# EAGLE schematic Shkaff (EAGLE 7.0.0)
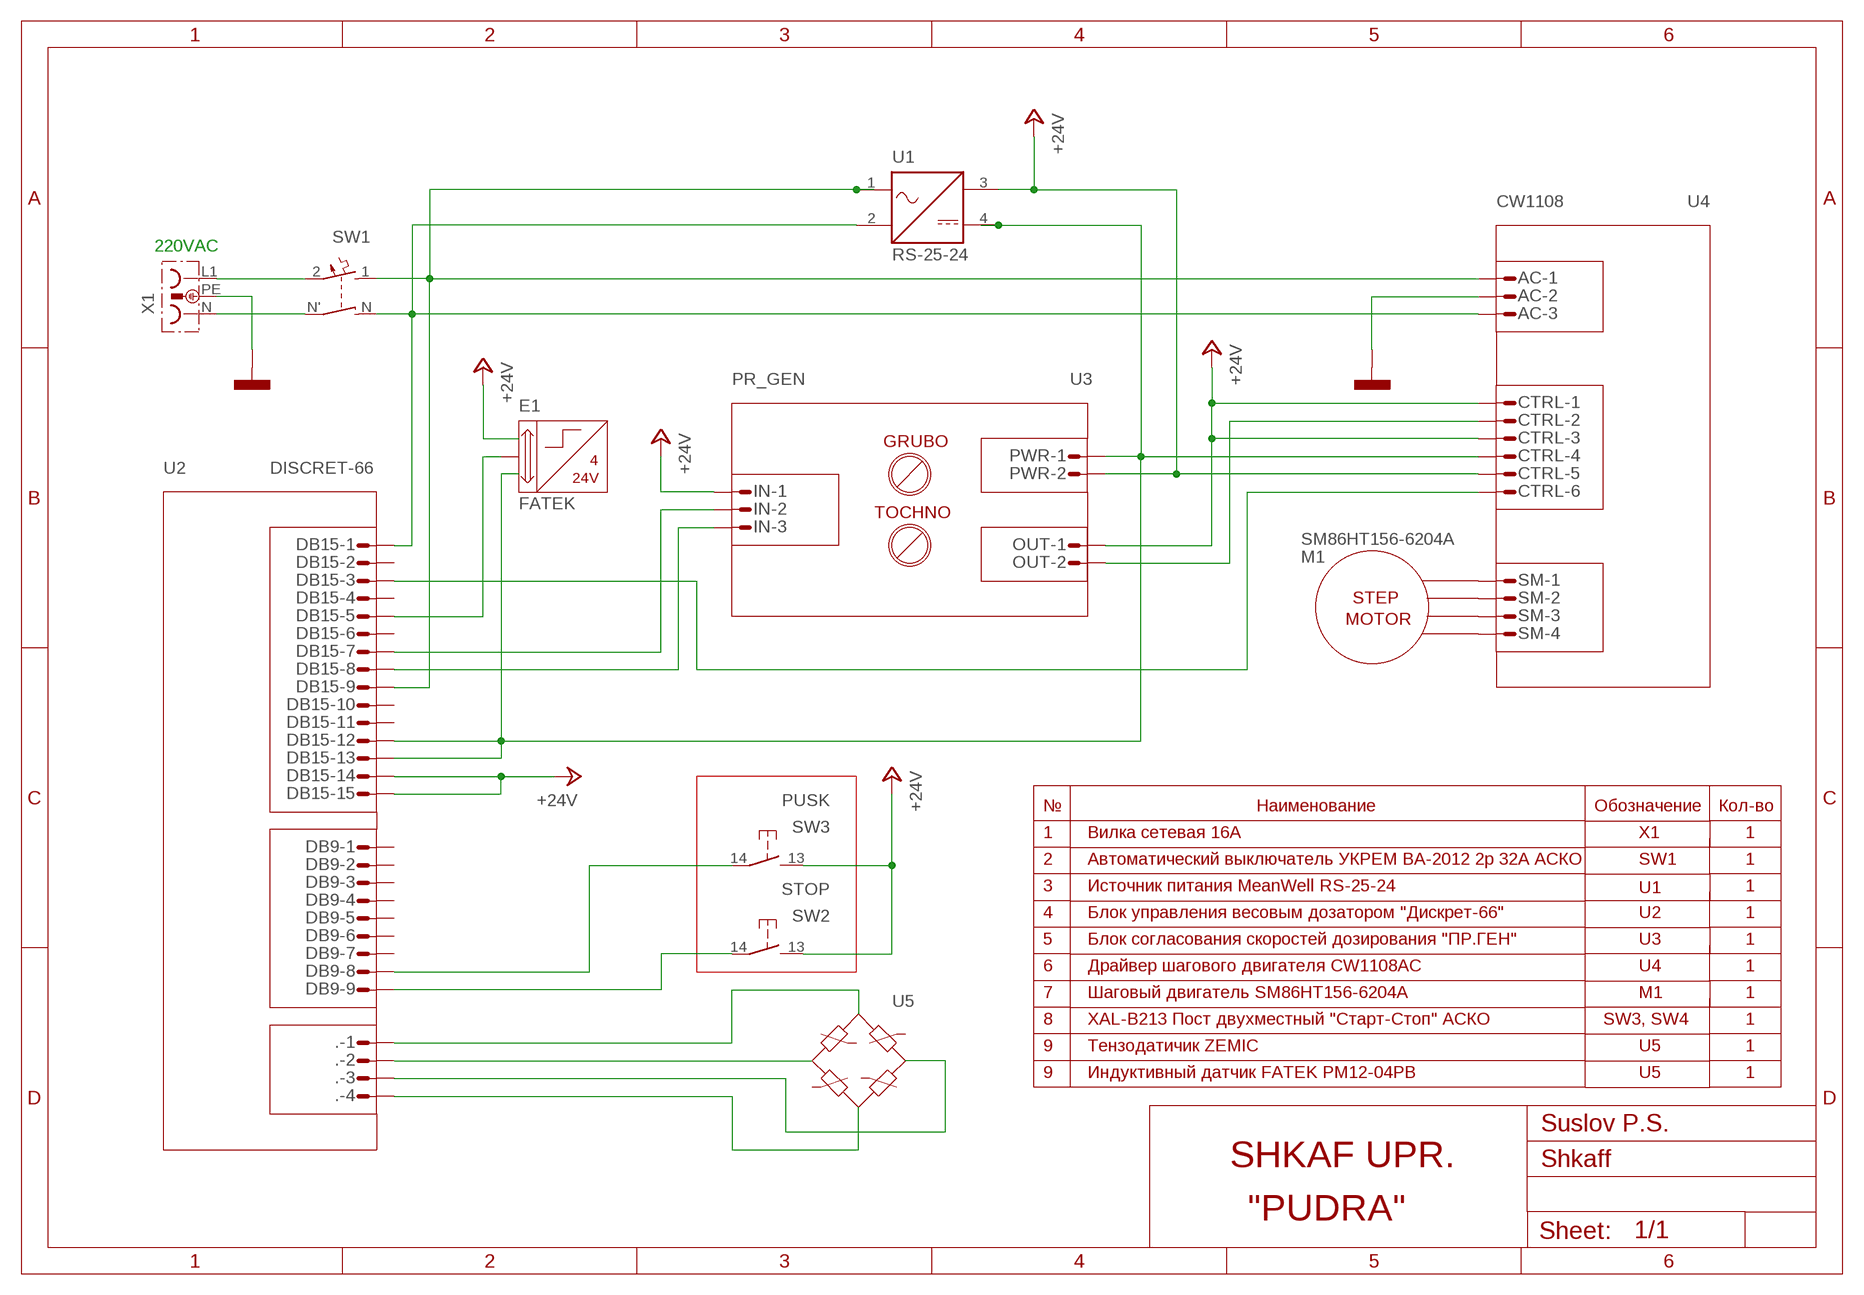
[diagram p0: schematic, sheet 1]

## Parts
.  L04P  [L04P]
AC  L04P  [L04P]
CTRL  L09P  [L09P]
DB9  L09P  [L09P]
DB15  L15P  [L15P]
E1  FATEK  6158EB  [6158EB]
IN  L04P  [L04P]
OUT  L04P  [L04P]
PWR  L04P  [L04P]
SM  L04P  [L04P]
SW1  LEITUNGSSCHUTZSCHALTER_2-POL  [LEITUNGSSCHUTZSCHALTER_2-POL]
SW2  STOP  SCHLIESSER_TASTSCHALTER  [SCHLIESSER_TASTSCHALTER]
SW3  PUSK  SCHLIESSER_TASTSCHALTER  [SCHLIESSER_TASTSCHALTER]
U1  RS-25-24  NETZTEIL_GLEICHSPANNUNG  [NETZTEIL_GLEICHSPANNUNG]
X1  STECKDOSE  [STECKDOSE]
X2  MASSE_ALLGEMEIN  [MASSE_ALLGEMEIN]
X6  MASSE_ALLGEMEIN  [MASSE_ALLGEMEIN]

## Nets
+24V: CTRL.1 CTRL.3 CTRL.5 DB15.14 DB15.15 IN.1 OUT.1 PWR.2 SW2.13 SW3.13 U1.3
N$1: AC.3 DB15.1 SW1.N U1.2
N$2: SW1.N'(N) X1.N
N$3: AC.2 X2.1(0V)
N$4: CTRL.6 DB15.3
N$5: DB15.8 IN.3
N$6: DB15.7 IN.2
N$7: CTRL.4 DB15.12 DB15.13 PWR.1 U1.4
N$8: DB9.9 SW2.14
N$9: DB9.8 SW3.14
N$10: CTRL.2 OUT.2
N$11: DB15.5 E1.1
N$14: X1.PE X6.1(0V)
N$16: ..1
N$17: ..2
N$18: ..3
N$19: ..4
N$27: AC.1 DB15.9 SW1.1 U1.1
SW1: SW1.2 X1.L1
Unconnected: AC.4 CTRL.7 CTRL.8 CTRL.9 DB9.1 DB9.2 DB9.3 DB9.4 DB9.5 DB9.6 DB9.7 DB15.2 DB15.4 DB15.6 DB15.10 DB15.11 IN.4 OUT.3 OUT.4 PWR.3 PWR.4 SM.1 SM.2 SM.3 SM.4

## Notes on the sheet
- CW1108 | U4
- 220VAC
- PR_GEN | U3
- GRUBO
- U2 | DISCRET-66
- TOCHNO
- SM86HT156-6204A
- M1
- STEP
- MOTOR
- № | Наименование | Обозначение | Кол-во
- 1 | Вилка сетевая 16А | X1 | 1
- 2 | Автоматический выключатель УКРЕМ ВА-2012 2р 32А АСКО | SW1 | 1
- 3 | Источник питания MeanWell RS-25-24 | U1 | 1
- 4 | Блок управления весовым дозатором "Дискрет-66" | U2 | 1
- 5 | Блок согласования скоростей дозирования "ПР.ГЕН" | U3 | 1
- 6 | Драйвер шагового двигателя CW1108AC | U4 | 1
- 7 | Шаговый двигатель SM86HT156-6204A | M1 | 1
- U5
- 8 | XAL-B213 Пост двухместный "Старт-Стоп" АСКО | SW3, SW4 | 1
- 9 | Тензодатичик ZEMIC | U5 | 1
- 9 | Индуктивный датчик FATEK PM12-04PB | U5 | 1
- Suslov P.S.
- SHKAF UPR.
- "PUDRA"

## Library data of the parts
. AC IN OUT PWR SM = con-amp-mt:L04P: AMP MT CONNECTOR; OC_FARNELL: unknown; OC_NEWARK: unknown
CTRL DB9 = con-amp-mt:L09P: AMP MT CONNECTOR; OC_FARNELL: unknown; OC_NEWARK: unknown
DB15 = con-amp-mt:L15P: AMP MT CONNECTOR; OC_FARNELL: unknown; OC_NEWARK: unknown
E1 = eib-busch-jaeger:6158EB: Binäreingang 4-fach Source: http://www.busch-jaeger-katalog.de http://www.busch-jaeger.de/de/elektroplaner/cad-symbole.htm
SW1 = e-sicherungen:LEITUNGSSCHUTZSCHALTER_2-POL: Leitungsschutzschalter, 2-pol.
SW2 SW3 = e-schalter:SCHLIESSER_TASTSCHALTER: Tastschalter, Schließer
U1 = e-stromversorgungselemente:NETZTEIL_GLEICHSPANNUNG: Netzteil, Gleichspannung
X1 = e-steckverbinder:STECKDOSE: Steckdose mit Schutzleiter
X2 X6 = e-klemmen:MASSE_ALLGEMEIN: Masse allgemein